# Altium schematic sheet IndicatorControl.SchDoc
size A4
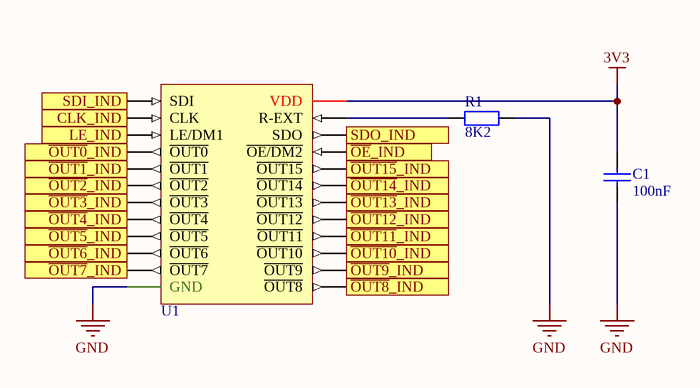
[diagram p0: IndicatorControl.SchDoc]

## Parts
C1  100nF  [FP_0805_CAP_085]
R1  8K2  [FP_0805_RES]
U1  STP16CP05TTR  [24-Pin TSSOP]  (value not drawn)

## Ports
CLK_IND (in), LE_IND (in), SDI_IND (in), SDO_IND (out), ~{OE}_IND (in), ~{OUT0}_IND (out), ~{OUT1}_IND (out), ~{OUT2}_IND (out), ~{OUT3}_IND (out), ~{OUT4}_IND (out), ~{OUT5}_IND (out), ~{OUT6}_IND (out), ~{OUT7}_IND (out), ~{OUT8}_IND (out), ~{OUT9}_IND (out), ~{OUT10}_IND (out), ~{OUT11}_IND (out), ~{OUT12}_IND (out), ~{OUT13}_IND (out), ~{OUT14}_IND (out), ~{OUT15}_IND (out)

## Nets
3V3: C1.2 U1.24(VDD)
GND: C1.1 R1.2 U1.1(GND)
CLK_IND: U1.3(CLK) ; port CLK_IND
LE_IND: U1.4(LE/DM1) ; port LE_IND
~{OE}_IND: U1.21(~{OE/DM2}) ; port ~{OE}_IND
~{OUT0}_IND: U1.5(~{OUT0}) ; port ~{OUT0}_IND
~{OUT10}_IND: U1.15(~{OUT10}) ; port ~{OUT10}_IND
~{OUT11}_IND: U1.16(~{OUT11}) ; port ~{OUT11}_IND
~{OUT12}_IND: U1.17(~{OUT12}) ; port ~{OUT12}_IND
~{OUT13}_IND: U1.18(~{OUT13}) ; port ~{OUT13}_IND
~{OUT14}_IND: U1.19(~{OUT14}) ; port ~{OUT14}_IND
~{OUT15}_IND: U1.20(~{OUT15}) ; port ~{OUT15}_IND
~{OUT1}_IND: U1.6(~{OUT1}) ; port ~{OUT1}_IND
~{OUT2}_IND: U1.7(~{OUT2}) ; port ~{OUT2}_IND
~{OUT3}_IND: U1.8(~{OUT3}) ; port ~{OUT3}_IND
~{OUT4}_IND: U1.9(~{OUT4}) ; port ~{OUT4}_IND
~{OUT5}_IND: U1.10(~{OUT5}) ; port ~{OUT5}_IND
~{OUT6}_IND: U1.11(~{OUT6}) ; port ~{OUT6}_IND
~{OUT7}_IND: U1.12(~{OUT7}) ; port ~{OUT7}_IND
~{OUT8}_IND: U1.13(~{OUT8}) ; port ~{OUT8}_IND
~{OUT9}_IND: U1.14(~{OUT9}) ; port ~{OUT9}_IND
SDI_IND: U1.2(SDI) ; port SDI_IND
SDO_IND: U1.22(SDO) ; port SDO_IND
NetR1_1: R1.1 U1.23(R-EXT)

## Library data of the parts
C1 = CAP 100nF: Capacitor; Tolerance: +80%/-20%; Voltage: 25V; Reference: 1759167; Name: SMD Multilayer Ceramic Capacitor, 0805; Supplier: Farnell; Value: 100nF
R1 = RES 8K2: Resistor; Tolerance: 5%; Power: 125mW; Name: YAGEO (PHYCOMP)  RC0805JR-078K2L  SMD Chip Resistor, Thick Film, 8.2 kohm; Reference: 9234128; Supplier: Farnell; Value: 8K2
U1 = STP16CP05TTR: Led Driver, 16 Outputs, Constant Current, 3V-5.5V in, 30MHz switch, 20V/100mA out, TSSOP-24